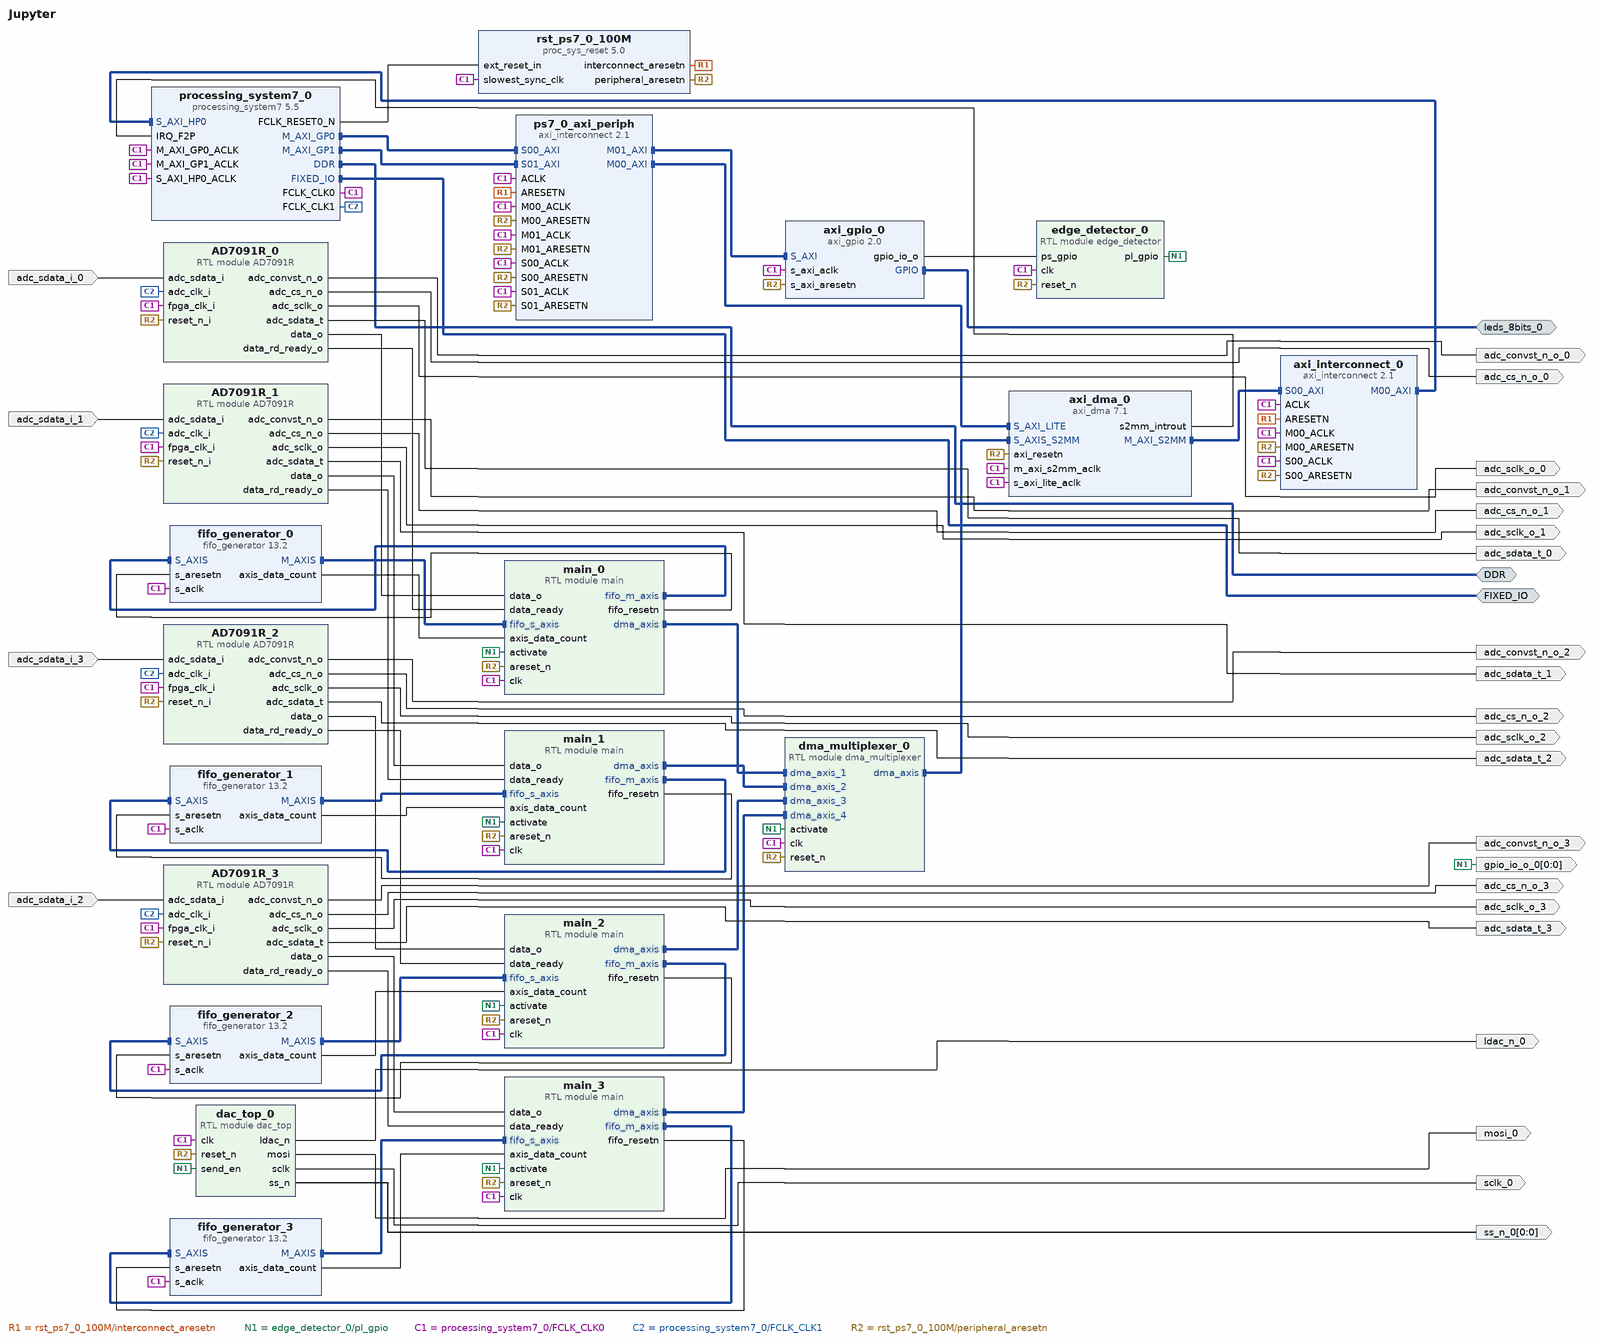
[diagram p0: block diagram of the top level]
# Vivado block design Jupyter, xc7z020clg484-1, Vivado 2023.2
create_bd_design Jupyter

create_bd_intf_port -mode Master -vlnv xilinx.com:interface:ddrx_rtl:1.0 DDR
create_bd_intf_port -mode Master -vlnv xilinx.com:interface:gpio_rtl:1.0 leds_8bits_0
create_bd_intf_port -mode Master -vlnv xilinx.com:display_processing_system7:fixedio_rtl:1.0 FIXED_IO
create_bd_port -dir O -from 0 -to 0 gpio_io_o_0
create_bd_port -dir O adc_cs_n_o_0
create_bd_port -dir O adc_sclk_o_0
create_bd_port -dir O adc_convst_n_o_0
create_bd_port -dir O adc_sdata_t_0
create_bd_port -dir O sclk_0
create_bd_port -dir O mosi_0
create_bd_port -dir O ldac_n_0
create_bd_port -dir O -from 0 -to 0 ss_n_0
create_bd_port -dir I adc_sdata_i_0
create_bd_port -dir O adc_sclk_o_1
create_bd_port -dir O adc_sdata_t_1
create_bd_port -dir O adc_cs_n_o_1
create_bd_port -dir O adc_convst_n_o_1
create_bd_port -dir I adc_sdata_i_1
create_bd_port -dir I adc_sdata_i_2
create_bd_port -dir O adc_sclk_o_2
create_bd_port -dir O adc_sdata_t_2
create_bd_port -dir O adc_cs_n_o_2
create_bd_port -dir O adc_convst_n_o_2
create_bd_port -dir O adc_sclk_o_3
create_bd_port -dir O adc_sdata_t_3
create_bd_port -dir O adc_cs_n_o_3
create_bd_port -dir O adc_convst_n_o_3
create_bd_port -dir I adc_sdata_i_3

create_bd_cell -type ip -vlnv xilinx.com:ip:processing_system7:5.5 processing_system7_0
set_property -dict [list \
  CONFIG.PCW_APU_PERIPHERAL_FREQMHZ 666.666667 \
  CONFIG.PCW_ENET0_ENET0_IO {MIO 16 .. 27} \
  CONFIG.PCW_ENET0_GRP_MDIO_ENABLE 1 \
  CONFIG.PCW_ENET0_GRP_MDIO_IO {MIO 52 .. 53} \
  CONFIG.PCW_ENET0_PERIPHERAL_ENABLE 1 \
  CONFIG.PCW_ENET0_RESET_ENABLE 0 \
  CONFIG.PCW_ENET_RESET_ENABLE 1 \
  CONFIG.PCW_ENET_RESET_SELECT {Share reset pin} \
  CONFIG.PCW_EN_CLK1_PORT 1 \
  CONFIG.PCW_FCLK_CLK1_BUF TRUE \
  CONFIG.PCW_FPGA0_PERIPHERAL_FREQMHZ 100.000000 \
  CONFIG.PCW_FPGA1_PERIPHERAL_FREQMHZ 50 \
  CONFIG.PCW_FPGA_FCLK1_ENABLE 1 \
  CONFIG.PCW_GPIO_MIO_GPIO_ENABLE 1 \
  CONFIG.PCW_GPIO_MIO_GPIO_IO MIO \
  CONFIG.PCW_I2C_RESET_ENABLE 1 \
  CONFIG.PCW_IRQ_F2P_INTR 1 \
  CONFIG.PCW_PERIPHERAL_BOARD_PRESET part0 \
  CONFIG.PCW_PRESET_BANK1_VOLTAGE {LVCMOS 1.8V} \
  CONFIG.PCW_QSPI_GRP_SINGLE_SS_ENABLE 1 \
  CONFIG.PCW_QSPI_GRP_SINGLE_SS_IO {MIO 1 .. 6} \
  CONFIG.PCW_QSPI_PERIPHERAL_ENABLE 1 \
  CONFIG.PCW_QSPI_QSPI_IO {MIO 1 .. 6} \
  CONFIG.PCW_SD0_GRP_CD_ENABLE 1 \
  CONFIG.PCW_SD0_GRP_CD_IO {MIO 47} \
  CONFIG.PCW_SD0_GRP_WP_ENABLE 1 \
  CONFIG.PCW_SD0_GRP_WP_IO {MIO 46} \
  CONFIG.PCW_SD0_PERIPHERAL_ENABLE 1 \
  CONFIG.PCW_SD0_SD0_IO {MIO 40 .. 45} \
  CONFIG.PCW_SDIO_PERIPHERAL_FREQMHZ 50 \
  CONFIG.PCW_SINGLE_QSPI_DATA_MODE x4 \
  CONFIG.PCW_TTC0_PERIPHERAL_ENABLE 1 \
  CONFIG.PCW_TTC0_TTC0_IO EMIO \
  CONFIG.PCW_UART1_PERIPHERAL_ENABLE 1 \
  CONFIG.PCW_UART1_UART1_IO {MIO 48 .. 49} \
  CONFIG.PCW_UART_PERIPHERAL_FREQMHZ 50 \
  CONFIG.PCW_UIPARAM_DDR_FREQ_MHZ 533.333313 \
  CONFIG.PCW_UIPARAM_DDR_PARTNO {MT41J128M16 HA-15E} \
  CONFIG.PCW_USB0_PERIPHERAL_ENABLE 1 \
  CONFIG.PCW_USB0_RESET_ENABLE 0 \
  CONFIG.PCW_USB0_USB0_IO {MIO 28 .. 39} \
  CONFIG.PCW_USB_RESET_ENABLE 1 \
  CONFIG.PCW_USB_RESET_SELECT {Share reset pin} \
  CONFIG.PCW_USE_FABRIC_INTERRUPT 1 \
  CONFIG.PCW_USE_M_AXI_GP1 1 \
  CONFIG.PCW_USE_S_AXI_HP0 1 \
  CONFIG.preset ZedBoard \
] [get_bd_cells processing_system7_0]
# 519 more settings of processing_system7_0 are not shown: defaults, MIO pin electricals, DDR timing, and values the tool derives
create_bd_cell -type ip -vlnv xilinx.com:ip:proc_sys_reset:5.0 rst_ps7_0_100M
create_bd_cell -type ip -vlnv xilinx.com:ip:axi_dma:7.1 axi_dma_0
set_property -dict {CONFIG.c_include_mm2s 0 CONFIG.c_include_sg 0 CONFIG.c_micro_dma 0} [get_bd_cells axi_dma_0]
create_bd_cell -type ip -vlnv xilinx.com:ip:axi_interconnect:2.1 ps7_0_axi_periph
set_property -dict {CONFIG.NUM_MI 2 CONFIG.NUM_SI 2} [get_bd_cells ps7_0_axi_periph]
create_bd_cell -type ip -vlnv xilinx.com:ip:axi_gpio:2.0 axi_gpio_0
set_property -dict [list \
  CONFIG.C_ALL_OUTPUTS 1 \
  CONFIG.C_GPIO_WIDTH 1 \
  CONFIG.GPIO_BOARD_INTERFACE Custom \
  CONFIG.USE_BOARD_FLOW true \
] [get_bd_cells axi_gpio_0]
create_bd_cell -type module -reference main main_0
create_bd_cell -type module -reference AD7091R AD7091R_0
create_bd_cell -type ip -vlnv xilinx.com:ip:fifo_generator:13.2 fifo_generator_0
set_property -dict [list \
  CONFIG.Enable_Data_Counts_axis true \
  CONFIG.INTERFACE_TYPE AXI_STREAM \
  CONFIG.Input_Depth_axis 2048 \
  CONFIG.TDATA_NUM_BYTES 32 \
] [get_bd_cells fifo_generator_0]
create_bd_cell -type module -reference dac_top dac_top_0
create_bd_cell -type module -reference edge_detector edge_detector_0
create_bd_cell -type module -reference AD7091R AD7091R_1
create_bd_cell -type module -reference main main_1
create_bd_cell -type ip -vlnv xilinx.com:ip:fifo_generator:13.2 fifo_generator_1
set_property -dict [list \
  CONFIG.Enable_Data_Counts_axis true \
  CONFIG.INTERFACE_TYPE AXI_STREAM \
  CONFIG.Input_Depth_axis 2048 \
  CONFIG.TDATA_NUM_BYTES 32 \
] [get_bd_cells fifo_generator_1]
create_bd_cell -type module -reference dma_multiplexer dma_multiplexer_0
set_property -dict {CONFIG.DATA_WIDTH 16} [get_bd_cells dma_multiplexer_0]
create_bd_cell -type module -reference AD7091R AD7091R_2
create_bd_cell -type module -reference AD7091R AD7091R_3
create_bd_cell -type module -reference main main_2
create_bd_cell -type module -reference main main_3
create_bd_cell -type ip -vlnv xilinx.com:ip:fifo_generator:13.2 fifo_generator_2
set_property -dict [list \
  CONFIG.Enable_Data_Counts_axis true \
  CONFIG.INTERFACE_TYPE AXI_STREAM \
  CONFIG.Input_Depth_axis 2048 \
  CONFIG.TDATA_NUM_BYTES 32 \
] [get_bd_cells fifo_generator_2]
create_bd_cell -type ip -vlnv xilinx.com:ip:fifo_generator:13.2 fifo_generator_3
set_property -dict [list \
  CONFIG.Enable_Data_Counts_axis true \
  CONFIG.INTERFACE_TYPE AXI_STREAM \
  CONFIG.Input_Depth_axis 2048 \
  CONFIG.TDATA_NUM_BYTES 32 \
] [get_bd_cells fifo_generator_3]
create_bd_cell -type ip -vlnv xilinx.com:ip:axi_interconnect:2.1 axi_interconnect_0
set_property -dict {CONFIG.NUM_MI 1} [get_bd_cells axi_interconnect_0]

# ---- connections ----

connect_bd_intf_net [get_bd_intf_pins axi_dma_0/M_AXI_S2MM] [get_bd_intf_pins axi_interconnect_0/S00_AXI]
connect_bd_intf_net [get_bd_intf_ports leds_8bits_0] [get_bd_intf_pins axi_gpio_0/GPIO]
connect_bd_intf_net [get_bd_intf_pins axi_interconnect_0/M00_AXI] [get_bd_intf_pins processing_system7_0/S_AXI_HP0]
connect_bd_intf_net [get_bd_intf_pins axi_dma_0/S_AXIS_S2MM] [get_bd_intf_pins dma_multiplexer_0/dma_axis]
connect_bd_intf_net [get_bd_intf_pins fifo_generator_0/M_AXIS] [get_bd_intf_pins main_0/fifo_s_axis]
connect_bd_intf_net [get_bd_intf_pins fifo_generator_1/M_AXIS] [get_bd_intf_pins main_1/fifo_s_axis]
connect_bd_intf_net [get_bd_intf_pins fifo_generator_2/M_AXIS] [get_bd_intf_pins main_2/fifo_s_axis]
connect_bd_intf_net [get_bd_intf_pins fifo_generator_3/M_AXIS] [get_bd_intf_pins main_3/fifo_s_axis]
connect_bd_intf_net [get_bd_intf_pins dma_multiplexer_0/dma_axis_1] [get_bd_intf_pins main_0/dma_axis]
connect_bd_intf_net [get_bd_intf_pins main_0/fifo_m_axis] [get_bd_intf_pins fifo_generator_0/S_AXIS]
connect_bd_intf_net [get_bd_intf_pins dma_multiplexer_0/dma_axis_2] [get_bd_intf_pins main_1/dma_axis]
connect_bd_intf_net [get_bd_intf_pins main_1/fifo_m_axis] [get_bd_intf_pins fifo_generator_1/S_AXIS]
connect_bd_intf_net [get_bd_intf_pins main_2/dma_axis] [get_bd_intf_pins dma_multiplexer_0/dma_axis_3]
connect_bd_intf_net [get_bd_intf_pins main_2/fifo_m_axis] [get_bd_intf_pins fifo_generator_2/S_AXIS]
connect_bd_intf_net [get_bd_intf_pins main_3/dma_axis] [get_bd_intf_pins dma_multiplexer_0/dma_axis_4]
connect_bd_intf_net [get_bd_intf_pins main_3/fifo_m_axis] [get_bd_intf_pins fifo_generator_3/S_AXIS]
connect_bd_intf_net [get_bd_intf_ports DDR] [get_bd_intf_pins processing_system7_0/DDR]
connect_bd_intf_net [get_bd_intf_ports FIXED_IO] [get_bd_intf_pins processing_system7_0/FIXED_IO]
connect_bd_intf_net [get_bd_intf_pins processing_system7_0/M_AXI_GP0] [get_bd_intf_pins ps7_0_axi_periph/S00_AXI]
connect_bd_intf_net [get_bd_intf_pins processing_system7_0/M_AXI_GP1] [get_bd_intf_pins ps7_0_axi_periph/S01_AXI]
connect_bd_intf_net [get_bd_intf_pins ps7_0_axi_periph/M00_AXI] [get_bd_intf_pins axi_dma_0/S_AXI_LITE]
connect_bd_intf_net [get_bd_intf_pins ps7_0_axi_periph/M01_AXI] [get_bd_intf_pins axi_gpio_0/S_AXI]
connect_bd_net [get_bd_pins AD7091R_0/adc_convst_n_o] [get_bd_ports adc_convst_n_o_0]
connect_bd_net [get_bd_pins AD7091R_0/adc_cs_n_o] [get_bd_ports adc_cs_n_o_0]
connect_bd_net [get_bd_pins AD7091R_0/adc_sclk_o] [get_bd_ports adc_sclk_o_0]
connect_bd_net [get_bd_pins AD7091R_0/adc_sdata_t] [get_bd_ports adc_sdata_t_0]
connect_bd_net [get_bd_pins AD7091R_0/data_o] [get_bd_pins main_0/data_o]
connect_bd_net [get_bd_pins AD7091R_0/data_rd_ready_o] [get_bd_pins main_0/data_ready]
connect_bd_net [get_bd_pins AD7091R_1/adc_convst_n_o] [get_bd_ports adc_convst_n_o_1]
connect_bd_net [get_bd_pins AD7091R_1/adc_cs_n_o] [get_bd_ports adc_cs_n_o_1]
connect_bd_net [get_bd_pins AD7091R_1/adc_sclk_o] [get_bd_ports adc_sclk_o_1]
connect_bd_net [get_bd_pins AD7091R_1/adc_sdata_t] [get_bd_ports adc_sdata_t_1]
connect_bd_net [get_bd_pins AD7091R_1/data_o] [get_bd_pins main_1/data_o]
connect_bd_net [get_bd_pins AD7091R_1/data_rd_ready_o] [get_bd_pins main_1/data_ready]
connect_bd_net [get_bd_pins AD7091R_2/adc_convst_n_o] [get_bd_ports adc_convst_n_o_2]
connect_bd_net [get_bd_pins AD7091R_2/adc_cs_n_o] [get_bd_ports adc_cs_n_o_2]
connect_bd_net [get_bd_pins AD7091R_2/adc_sclk_o] [get_bd_ports adc_sclk_o_2]
connect_bd_net [get_bd_pins AD7091R_2/adc_sdata_t] [get_bd_ports adc_sdata_t_2]
connect_bd_net [get_bd_pins AD7091R_2/data_o] [get_bd_pins main_2/data_o]
connect_bd_net [get_bd_pins AD7091R_2/data_rd_ready_o] [get_bd_pins main_2/data_ready]
connect_bd_net [get_bd_pins AD7091R_3/adc_convst_n_o] [get_bd_ports adc_convst_n_o_3]
connect_bd_net [get_bd_pins AD7091R_3/adc_cs_n_o] [get_bd_ports adc_cs_n_o_3]
connect_bd_net [get_bd_pins AD7091R_3/adc_sclk_o] [get_bd_ports adc_sclk_o_3]
connect_bd_net [get_bd_pins AD7091R_3/adc_sdata_t] [get_bd_ports adc_sdata_t_3]
connect_bd_net [get_bd_pins AD7091R_3/data_o] [get_bd_pins main_3/data_o]
connect_bd_net [get_bd_pins AD7091R_3/data_rd_ready_o] [get_bd_pins main_3/data_ready]
connect_bd_net -net ARESETN_1 [get_bd_pins rst_ps7_0_100M/interconnect_aresetn] \
  [get_bd_pins ps7_0_axi_periph/ARESETN] [get_bd_pins axi_interconnect_0/ARESETN]
connect_bd_net -net adc_sdata_i_0_1 [get_bd_ports adc_sdata_i_0] [get_bd_pins AD7091R_0/adc_sdata_i]
connect_bd_net -net adc_sdata_i_1_2 [get_bd_ports adc_sdata_i_1] [get_bd_pins AD7091R_1/adc_sdata_i]
connect_bd_net -net adc_sdata_i_2_1 [get_bd_ports adc_sdata_i_2] [get_bd_pins AD7091R_3/adc_sdata_i]
connect_bd_net -net adc_sdata_i_3_1 [get_bd_ports adc_sdata_i_3] [get_bd_pins AD7091R_2/adc_sdata_i]
connect_bd_net [get_bd_pins axi_dma_0/s2mm_introut] [get_bd_pins processing_system7_0/IRQ_F2P]
connect_bd_net -net axi_gpio_0_gpio_io_o [get_bd_pins edge_detector_0/pl_gpio] \
  [get_bd_ports gpio_io_o_0] [get_bd_pins dac_top_0/send_en] [get_bd_pins dma_multiplexer_0/activate] \
  [get_bd_pins main_0/activate] [get_bd_pins main_1/activate] [get_bd_pins main_2/activate] [get_bd_pins main_3/activate]
connect_bd_net [get_bd_pins axi_gpio_0/gpio_io_o] [get_bd_pins edge_detector_0/ps_gpio]
connect_bd_net [get_bd_pins dac_top_0/ldac_n] [get_bd_ports ldac_n_0]
connect_bd_net [get_bd_pins dac_top_0/mosi] [get_bd_ports mosi_0]
connect_bd_net [get_bd_pins dac_top_0/sclk] [get_bd_ports sclk_0]
connect_bd_net [get_bd_pins dac_top_0/ss_n] [get_bd_ports ss_n_0]
connect_bd_net [get_bd_pins fifo_generator_0/axis_data_count] [get_bd_pins main_0/axis_data_count]
connect_bd_net [get_bd_pins fifo_generator_1/axis_data_count] [get_bd_pins main_1/axis_data_count]
connect_bd_net [get_bd_pins fifo_generator_2/axis_data_count] [get_bd_pins main_2/axis_data_count]
connect_bd_net [get_bd_pins fifo_generator_3/axis_data_count] [get_bd_pins main_3/axis_data_count]
connect_bd_net [get_bd_pins main_0/fifo_resetn] [get_bd_pins fifo_generator_0/s_aresetn]
connect_bd_net [get_bd_pins main_1/fifo_resetn] [get_bd_pins fifo_generator_1/s_aresetn]
connect_bd_net [get_bd_pins main_2/fifo_resetn] [get_bd_pins fifo_generator_2/s_aresetn]
connect_bd_net [get_bd_pins main_3/fifo_resetn] [get_bd_pins fifo_generator_3/s_aresetn]
connect_bd_net [get_bd_pins processing_system7_0/FCLK_CLK0] \
  [get_bd_pins processing_system7_0/M_AXI_GP0_ACLK] [get_bd_pins rst_ps7_0_100M/slowest_sync_clk] \
  [get_bd_pins processing_system7_0/S_AXI_HP0_ACLK] [get_bd_pins processing_system7_0/M_AXI_GP1_ACLK] \
  [get_bd_pins ps7_0_axi_periph/S00_ACLK] [get_bd_pins axi_dma_0/s_axi_lite_aclk] [get_bd_pins ps7_0_axi_periph/M00_ACLK] \
  [get_bd_pins ps7_0_axi_periph/ACLK] [get_bd_pins axi_dma_0/m_axi_s2mm_aclk] [get_bd_pins ps7_0_axi_periph/S01_ACLK] \
  [get_bd_pins axi_gpio_0/s_axi_aclk] [get_bd_pins ps7_0_axi_periph/M01_ACLK] [get_bd_pins fifo_generator_0/s_aclk] \
  [get_bd_pins AD7091R_0/fpga_clk_i] [get_bd_pins edge_detector_0/clk] [get_bd_pins fifo_generator_1/s_aclk] \
  [get_bd_pins AD7091R_1/fpga_clk_i] [get_bd_pins fifo_generator_3/s_aclk] [get_bd_pins AD7091R_2/fpga_clk_i] \
  [get_bd_pins AD7091R_3/fpga_clk_i] [get_bd_pins fifo_generator_2/s_aclk] [get_bd_pins dac_top_0/clk] \
  [get_bd_pins axi_interconnect_0/ACLK] [get_bd_pins axi_interconnect_0/M00_ACLK] [get_bd_pins axi_interconnect_0/S00_ACLK] \
  [get_bd_pins dma_multiplexer_0/clk] [get_bd_pins main_0/clk] [get_bd_pins main_1/clk] [get_bd_pins main_2/clk] \
  [get_bd_pins main_3/clk]
connect_bd_net [get_bd_pins processing_system7_0/FCLK_CLK1] \
  [get_bd_pins AD7091R_0/adc_clk_i] [get_bd_pins AD7091R_1/adc_clk_i] [get_bd_pins AD7091R_2/adc_clk_i] \
  [get_bd_pins AD7091R_3/adc_clk_i]
connect_bd_net [get_bd_pins processing_system7_0/FCLK_RESET0_N] [get_bd_pins rst_ps7_0_100M/ext_reset_in]
connect_bd_net [get_bd_pins rst_ps7_0_100M/peripheral_aresetn] \
  [get_bd_pins ps7_0_axi_periph/S00_ARESETN] [get_bd_pins axi_dma_0/axi_resetn] [get_bd_pins ps7_0_axi_periph/M00_ARESETN] \
  [get_bd_pins ps7_0_axi_periph/S01_ARESETN] [get_bd_pins axi_gpio_0/s_axi_aresetn] \
  [get_bd_pins ps7_0_axi_periph/M01_ARESETN] [get_bd_pins AD7091R_0/reset_n_i] [get_bd_pins edge_detector_0/reset_n] \
  [get_bd_pins AD7091R_1/reset_n_i] [get_bd_pins AD7091R_3/reset_n_i] [get_bd_pins AD7091R_2/reset_n_i] \
  [get_bd_pins dac_top_0/reset_n] [get_bd_pins axi_interconnect_0/M00_ARESETN] [get_bd_pins axi_interconnect_0/S00_ARESETN] \
  [get_bd_pins dma_multiplexer_0/reset_n] [get_bd_pins main_0/areset_n] [get_bd_pins main_1/areset_n] \
  [get_bd_pins main_2/areset_n] [get_bd_pins main_3/areset_n]

# ---- address map ----
assign_bd_address -offset 0x00000000 -range 512M -target_address_space [get_bd_addr_spaces axi_dma_0/Data_S2MM] [get_bd_addr_segs processing_system7_0/S_AXI_HP0/HP0_DDR_LOWOCM]
assign_bd_address -offset 0x40000000 -range 64K -target_address_space [get_bd_addr_spaces processing_system7_0/Data] [get_bd_addr_segs axi_dma_0/S_AXI_LITE/Reg]
assign_bd_address -offset 0x80000000 -range 128 -target_address_space [get_bd_addr_spaces processing_system7_0/Data] [get_bd_addr_segs axi_gpio_0/S_AXI/Reg]

validate_bd_design
save_bd_design
